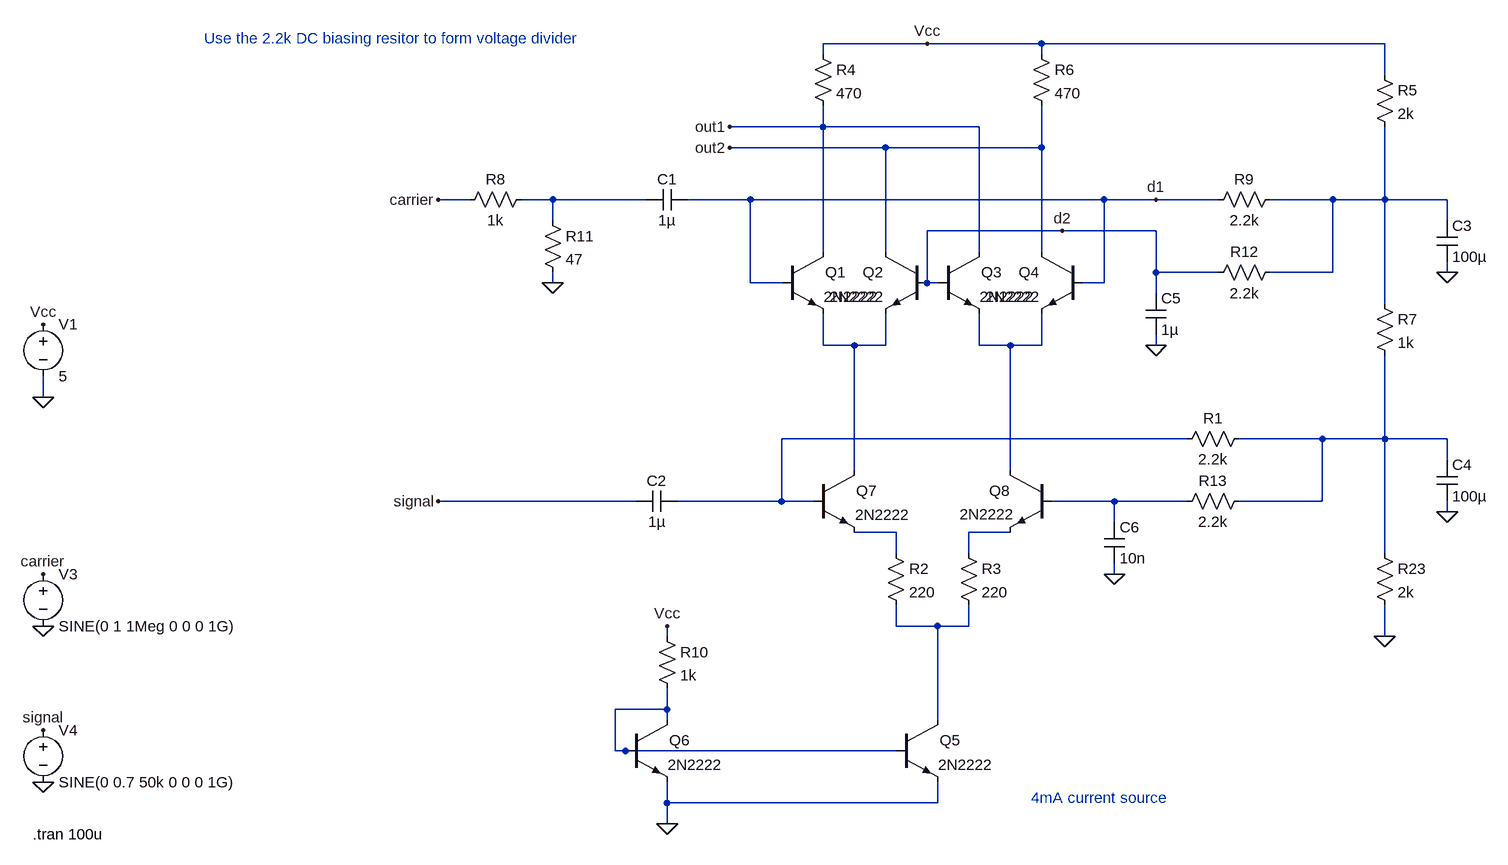
[diagram p0: schematic 10MHz_gilbert_cell.asc]
10MHz_gilbert_cell.asc, the LTspice schematic file:
Version 4
SHEET 1 2944 1096
WIRE 288 -208 128 -208
WIRE 464 -208 288 -208
WIRE 992 -208 464 -208
WIRE 128 -192 128 -208
WIRE 464 -192 464 -208
WIRE 992 -160 992 -208
WIRE 128 -80 128 -112
WIRE 128 -80 -16 -80
WIRE 368 -80 128 -80
WIRE 224 -48 -16 -48
WIRE 464 -48 464 -112
WIRE 464 -48 224 -48
WIRE -416 32 -464 32
WIRE -288 32 -336 32
WIRE -144 32 -288 32
WIRE 16 32 -80 32
WIRE 560 32 16 32
WIRE 640 32 560 32
WIRE 736 32 640 32
WIRE 912 32 816 32
WIRE 992 32 992 -80
WIRE 992 32 912 32
WIRE 1088 32 992 32
WIRE -288 64 -288 32
WIRE 1088 64 1088 32
WIRE 496 80 288 80
WIRE 640 80 496 80
WIRE 128 112 128 -80
WIRE 224 112 224 -48
WIRE 368 112 368 -80
WIRE 464 112 464 -48
WIRE 640 144 640 80
WIRE 736 144 640 144
WIRE 912 144 912 32
WIRE 912 144 816 144
WIRE 1088 144 1088 128
WIRE -288 160 -288 144
WIRE 16 160 16 32
WIRE 64 160 16 160
WIRE 288 160 288 80
WIRE 304 160 288 160
WIRE 560 160 560 32
WIRE 560 160 528 160
WIRE 640 176 640 144
WIRE 992 192 992 32
WIRE 128 256 128 208
WIRE 176 256 128 256
WIRE 224 256 224 208
WIRE 224 256 176 256
WIRE 368 256 368 208
WIRE 416 256 368 256
WIRE 464 256 464 208
WIRE 464 256 416 256
WIRE 640 256 640 240
WIRE -1072 336 -1072 304
WIRE 688 400 64 400
WIRE 896 400 768 400
WIRE 992 400 992 272
WIRE 992 400 896 400
WIRE 1088 400 992 400
WIRE 1088 432 1088 400
WIRE 176 448 176 256
WIRE 416 448 416 256
WIRE -160 496 -464 496
WIRE 64 496 64 400
WIRE 64 496 -96 496
WIRE 112 496 64 496
WIRE 576 496 480 496
WIRE 688 496 576 496
WIRE 896 496 896 400
WIRE 896 496 768 496
WIRE 1088 512 1088 496
WIRE 576 528 576 496
WIRE 240 544 176 544
WIRE 416 544 352 544
WIRE 240 576 240 544
WIRE 352 576 352 544
WIRE 992 576 992 400
WIRE 576 608 576 592
WIRE 240 688 240 656
WIRE 304 688 240 688
WIRE 352 688 352 656
WIRE 352 688 304 688
WIRE -112 704 -112 688
WIRE 992 704 992 656
WIRE -112 816 -112 784
WIRE -112 816 -192 816
WIRE -112 832 -112 816
WIRE 304 832 304 688
WIRE -192 880 -192 816
WIRE -176 880 -192 880
WIRE 240 880 -176 880
WIRE -112 960 -112 928
WIRE 304 960 304 928
WIRE 304 960 -112 960
WIRE -112 992 -112 960
FLAG 288 -208 Vcc
FLAG -1072 336 0
FLAG -1072 224 Vcc
FLAG -1072 688 0
FLAG -1072 928 0
FLAG -1072 608 carrier
FLAG -1072 848 signal
FLAG -464 496 signal
FLAG -464 32 carrier
FLAG -16 -80 out1
FLAG -16 -48 out2
FLAG -112 992 0
FLAG -112 688 Vcc
FLAG 640 32 d1
FLAG 496 80 d2
FLAG -288 160 0
FLAG 992 704 0
FLAG 1088 512 0
FLAG 1088 144 0
FLAG 640 256 0
FLAG 576 608 0
SYMBOL voltage -1072 208 R0
WINDOW 123 0 0 Left 0
WINDOW 39 0 0 Left 0
SYMATTR InstName V1
SYMATTR Value 5
SYMBOL voltage -1072 592 R0
WINDOW 123 0 0 Left 0
WINDOW 39 0 0 Left 0
SYMATTR InstName V3
SYMATTR Value SINE(0 1 1Meg 0 0 0 1G)
SYMBOL voltage -1072 832 R0
WINDOW 123 0 0 Left 0
WINDOW 39 0 0 Left 0
SYMATTR InstName V4
SYMATTR Value SINE(0 0.7 50k 0 0 0 1G)
SYMBOL npn 112 448 R0
WINDOW 0 67 32 Left 2
WINDOW 3 65 69 Left 2
SYMATTR InstName Q7
SYMATTR Value 2N2222
SYMBOL npn 480 448 M0
WINDOW 0 64 32 Left 2
WINDOW 3 57 68 Left 2
SYMATTR InstName Q8
SYMATTR Value 2N2222
SYMBOL cap -80 16 R90
WINDOW 0 0 32 VBottom 2
WINDOW 3 32 32 VTop 2
SYMATTR InstName C1
SYMATTR Value 1µ
SYMBOL cap -96 480 R90
WINDOW 0 0 32 VBottom 2
WINDOW 3 32 32 VTop 2
SYMATTR InstName C2
SYMATTR Value 1µ
SYMBOL res 784 384 R90
WINDOW 0 0 56 VBottom 2
WINDOW 3 32 56 VTop 2
SYMATTR InstName R1
SYMATTR Value 2.2k
SYMBOL res 112 -208 R0
SYMATTR InstName R4
SYMATTR Value 470
SYMBOL res 448 -208 R0
SYMATTR InstName R6
SYMATTR Value 470
SYMBOL npn 64 112 R0
WINDOW 0 67 32 Left 2
WINDOW 3 65 69 Left 2
SYMATTR InstName Q1
SYMATTR Value 2N2222
SYMBOL npn 288 112 M0
WINDOW 0 67 32 Left 2
WINDOW 3 65 69 Left 2
SYMATTR InstName Q2
SYMATTR Value 2N2222
SYMBOL npn 304 112 R0
WINDOW 0 67 32 Left 2
WINDOW 3 65 69 Left 2
SYMATTR InstName Q3
SYMATTR Value 2N2222
SYMBOL npn 528 112 M0
WINDOW 0 67 32 Left 2
WINDOW 3 65 69 Left 2
SYMATTR InstName Q4
SYMATTR Value 2N2222
SYMBOL npn 240 832 R0
WINDOW 0 67 32 Left 2
WINDOW 3 65 69 Left 2
SYMATTR InstName Q5
SYMATTR Value 2N2222
SYMBOL npn -176 832 R0
WINDOW 0 67 32 Left 2
WINDOW 3 65 69 Left 2
SYMATTR InstName Q6
SYMATTR Value 2N2222
SYMBOL res -128 688 R0
SYMATTR InstName R10
SYMATTR Value 1k
SYMBOL res 224 560 R0
SYMATTR InstName R2
SYMATTR Value 220
SYMBOL res 336 560 R0
SYMATTR InstName R3
SYMATTR Value 220
SYMBOL res -320 16 R90
WINDOW 0 0 56 VBottom 2
WINDOW 3 32 56 VTop 2
SYMATTR InstName R8
SYMATTR Value 1k
SYMBOL res -304 48 R0
SYMATTR InstName R11
SYMATTR Value 47
SYMBOL res 976 -176 R0
SYMATTR InstName R5
SYMATTR Value 2k
SYMBOL res 976 176 R0
SYMATTR InstName R7
SYMATTR Value 1k
SYMBOL res 976 560 R0
SYMATTR InstName R23
SYMATTR Value 2k
SYMBOL cap 1072 64 R0
SYMATTR InstName C3
SYMATTR Value 100µ
SYMBOL cap 1072 432 R0
SYMATTR InstName C4
SYMATTR Value 100µ
SYMBOL res 832 16 R90
WINDOW 0 0 56 VBottom 2
WINDOW 3 32 56 VTop 2
SYMATTR InstName R9
SYMATTR Value 2.2k
SYMBOL res 832 128 R90
WINDOW 0 0 56 VBottom 2
WINDOW 3 32 56 VTop 2
SYMATTR InstName R12
SYMATTR Value 2.2k
SYMBOL cap 624 176 R0
SYMATTR InstName C5
SYMATTR Value 1µ
SYMBOL res 784 480 R90
WINDOW 0 0 56 VBottom 2
WINDOW 3 32 56 VTop 2
SYMATTR InstName R13
SYMATTR Value 2.2k
SYMBOL cap 560 528 R0
SYMATTR InstName C6
SYMATTR Value 10n
TEXT -1088 1008 Left 2 !.tran 100u
TEXT -824 -216 Left 2 ;Use the 2.2k DC biasing resitor to form voltage divider
TEXT 448 952 Left 2 ;4mA current source

The netlist it stands for:
* 10MHz_gilbert_cell.asc
V1 Vcc 0 5
V3 carrier 0 SINE(0 1 1Meg 0 0 0 1G)
V4 signal 0 SINE(0 0.7 50k 0 0 0 1G)
Q7 N003 N005 N008 0 2N2222
Q8 N004 N007 N009 0 2N2222
C1 d1 N001 1µ
C2 N005 signal 1µ
R1 N006 N005 2.2k
R4 Vcc out1 470
R6 Vcc out2 470
Q1 out1 d1 N003 0 2N2222
Q2 out2 d2 N003 0 2N2222
Q3 out1 d2 N004 0 2N2222
Q4 out2 d1 N004 0 2N2222
Q5 N010 N011 0 0 2N2222
Q6 N011 N011 0 0 2N2222
R10 Vcc N011 1k
R2 N008 N010 220
R3 N009 N010 220
R8 N001 carrier 1k
R11 N001 0 47
R5 Vcc N002 2k
R7 N002 N006 1k
R23 N006 0 2k
C3 N002 0 100µ
C4 N006 0 100µ
R9 N002 d1 2.2k
R12 N002 d2 2.2k
C5 d2 0 1µ
R13 N006 N007 2.2k
C6 N007 0 10n
.model NPN NPN
.model PNP PNP
.lib standard.bjt
.tran 100u
* Use the 2.2k DC biasing resitor to form voltage divider
* 4mA current source
.backanno
.end